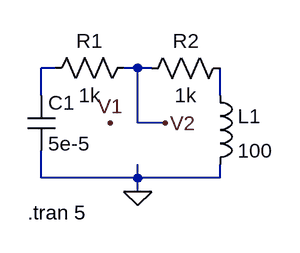
[diagram p0: schematic Draft5.asc]
Draft5.asc, the LTspice schematic file:
Version 4.1
SHEET 1 880 680
WIRE -128 80 -144 80
WIRE -32 80 -48 80
WIRE -16 80 -32 80
WIRE -144 112 -144 80
WIRE 64 112 64 80
WIRE -32 144 -32 80
WIRE 0 144 -32 144
WIRE -144 208 -144 176
WIRE -32 208 -32 192
WIRE -32 208 -144 208
WIRE 64 208 64 192
WIRE 64 208 -32 208
WIRE -32 224 -32 208
FLAG -32 224 0
FLAG -64 144 V1
FLAG 0 144 V2
SYMBOL cap -160 112 R0
SYMATTR InstName C1
SYMATTR Value 5e-5
SYMBOL ind 48 96 R0
SYMATTR InstName L1
SYMATTR Value 100
SYMBOL res -32 64 R90
WINDOW 0 0 56 VBottom 2
WINDOW 3 32 56 VTop 2
SYMATTR InstName R1
SYMATTR Value 1k
SYMBOL res -32 96 R270
WINDOW 0 32 56 VTop 2
WINDOW 3 0 56 VBottom 2
SYMATTR InstName R2
SYMATTR Value 1k
TEXT -160 248 Left 2 !.tran 5

The netlist it stands for:
* Draft5.asc
C1 N001 0 5e-5
L1 N002 0 100
R1 V2 N001 1k
R2 V2 N002 1k
.tran 5
.backanno
.end